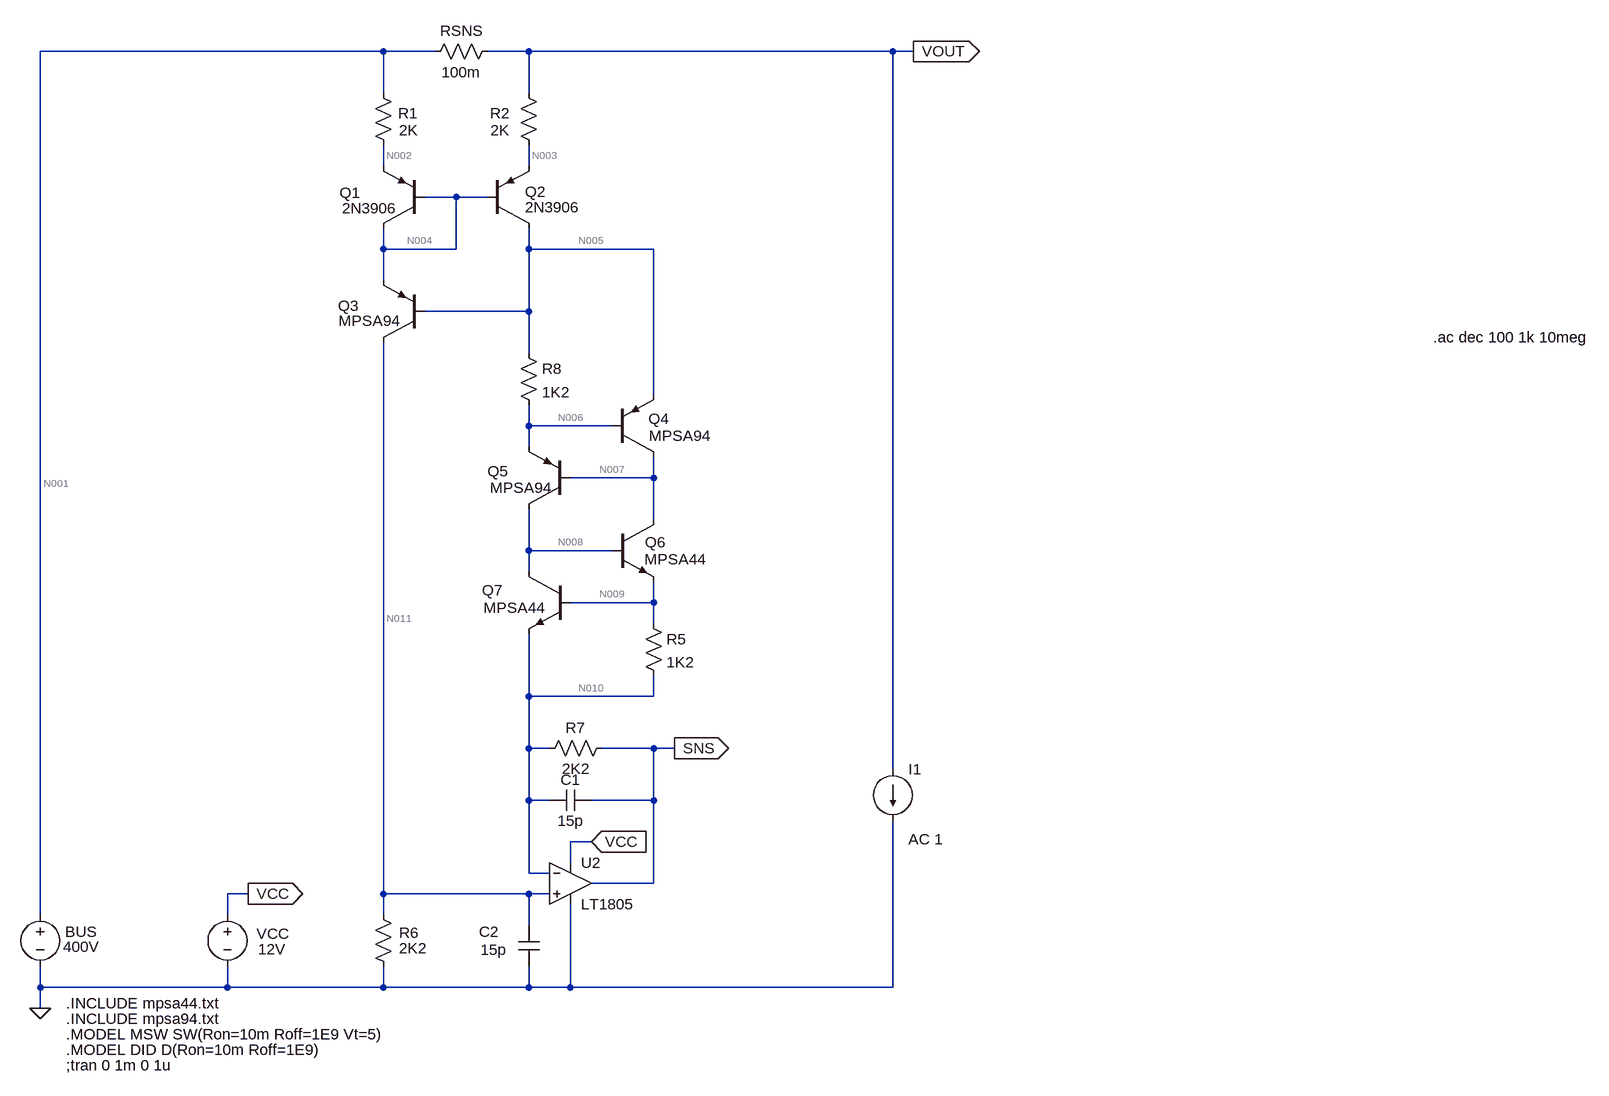
[diagram p0: schematic param_sweep.asc]
* param_sweep.asc
RSNS VOUT N001 100m
R1 N001 N002 2K
R2 VOUT N003 2K
Q1 N004 N004 N002 0 2N3906
Q2 N005 N004 N003 0 2N3906
R6 N011 0 2K2
R7 SNS N010 2K2
V§BUS N001 0 400V
Q7 N008 N009 N010 0 MPSA44
R8 N005 N006 1K2
R5 N009 N010 1K2
Q3 N011 N005 N004 0 MPSA94
VCC VCC 0 12V
C1 SNS N010 15p
C2 0 N011 15p
Q5 N008 N007 N006 0 MPSA94
Q4 N007 N006 N005 0 MPSA94
Q6 N007 N008 N009 0 MPSA44
I1 VOUT 0 AC 1
* U2: LT1805 (symbol Opamps\LT1805 not available, pins judged from their places): In+=N011 In-=N010 V+=VCC V-=0 OUT=SNS
.model NPN NPN
.model PNP PNP
.lib standard.bjt
.MODEL MSW SW(Ron=10m Roff=1E9 Vt=5)
.MODEL DID D(Ron=10m Roff=1E9)
;tran 0 1m 0 1u
.INCLUDE mpsa44.txt
.INCLUDE mpsa94.txt
.ac dec 100 1k 10meg
.backanno
.end

* Results of the author's LTspice run, read from the files saved beside the schematic
* Operating Point, zero values left out:
*   V(vout) = 400 V
*   V(n001) = 400 V
*   V(n002) = 398 V
*   V(n003) = 398 V
*   V(n004) = 397.4 V
*   V(n005) = 396.9 V
*   V(n011) = 2.175 V
*   V(sns) = 21.79 mV
*   V(n010) = 2.175 V
*   V(n008) = 3.288 V
*   V(n009) = 2.769 V
*   V(n006) = 396.3 V
*   V(vcc) = 12 V
*   V(n007) = 395.9 V
*   Ic(Q4) = -501.4 µA
*   Ib(Q4) = -6.139 µA
*   Ie(Q4) = 507.6 µA
*   Ic(Q5) = -477.6 µA
*   Ib(Q5) = 264.4 nA
*   Ie(Q5) = 477.4 µA
*   Ic(Q3) = -988.6 µA
*   Ib(Q3) = 39.42 nA
*   Ie(Q3) = 988.6 µA
*   Ic(Q6) = 501.2 µA
*   Ib(Q6) = 355.9 nA
*   Ie(Q6) = -501.5 µA
*   Ic(Q7) = 477.3 µA
*   Ib(Q7) = 6.505 µA
*   Ie(Q7) = -483.8 µA
*   Ic(Q2) = -978.8 µA
*   Ib(Q2) = -4.882 µA
*   Ie(Q2) = 983.7 µA
*   Ic(Q1) = -978.8 µA
*   Ib(Q1) = -4.906 µA
*   Ie(Q1) = 983.7 µA
*   I(R5) = 495 µA
*   I(R8) = 471.2 µA
*   I(R7) = -978.9 µA
*   I(R6) = 988.7 µA
*   I(R2) = 983.7 µA
*   I(R1) = 983.7 µA
*   I(Rsns) = -983.7 µA
*   I(Vcc) = -1.943 mA
*   I(Bus) = -1.967 mA
*   Ix(u2:1) = -126.6 nA
*   Ix(u2:2) = -126.6 nA
*   Ix(u2:3) = 978.9 µA
*   Ix(u2:4) = 1.943 mA
*   Ix(u2:5) = -2.922 mA
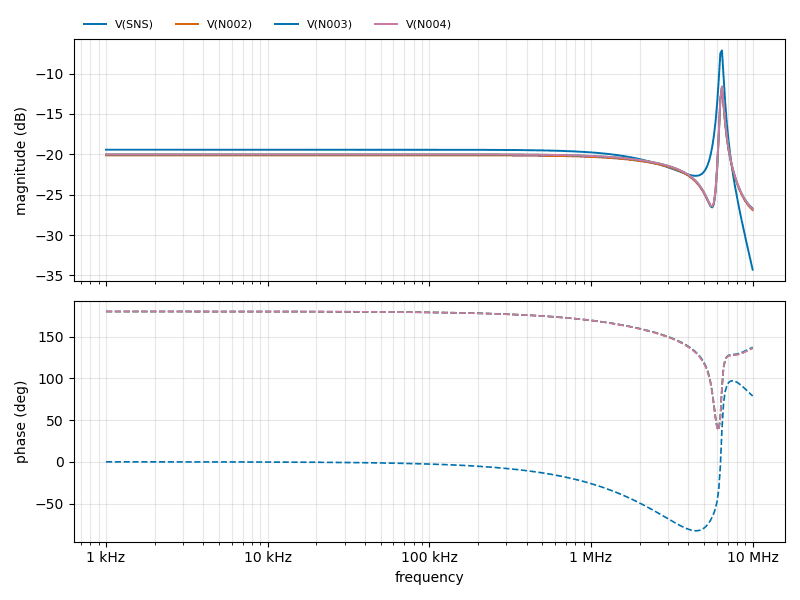
[diagram p1: AC Analysis of param_sweep.asc, plotted from the saved traces]
* AC Analysis, 1 run:
*   V(SNS): -19.43 dB at 1 kHz, -34.29 dB at 10 MHz, peak -7.12 dB at 6.457 MHz, 3 dB below the peak at 6.194 MHz and 6.597 MHz
*   V(N002): -20.12 dB at 1 kHz, -26.89 dB at 10 MHz, peak -11.68 dB at 6.457 MHz, 3 dB below the peak at 6.262 MHz and 6.661 MHz
*   V(N003): -20.00 dB at 1 kHz, -26.71 dB at 10 MHz, peak -11.68 dB at 6.457 MHz, 3 dB below the peak at 6.263 MHz and 6.663 MHz
*   V(N004): -20.00 dB at 1 kHz, -26.78 dB at 10 MHz, peak -11.57 dB at 6.457 MHz, 3 dB below the peak at 6.262 MHz and 6.661 MHz